# Altium schematic sheet Output_protection.SchDoc
size A3
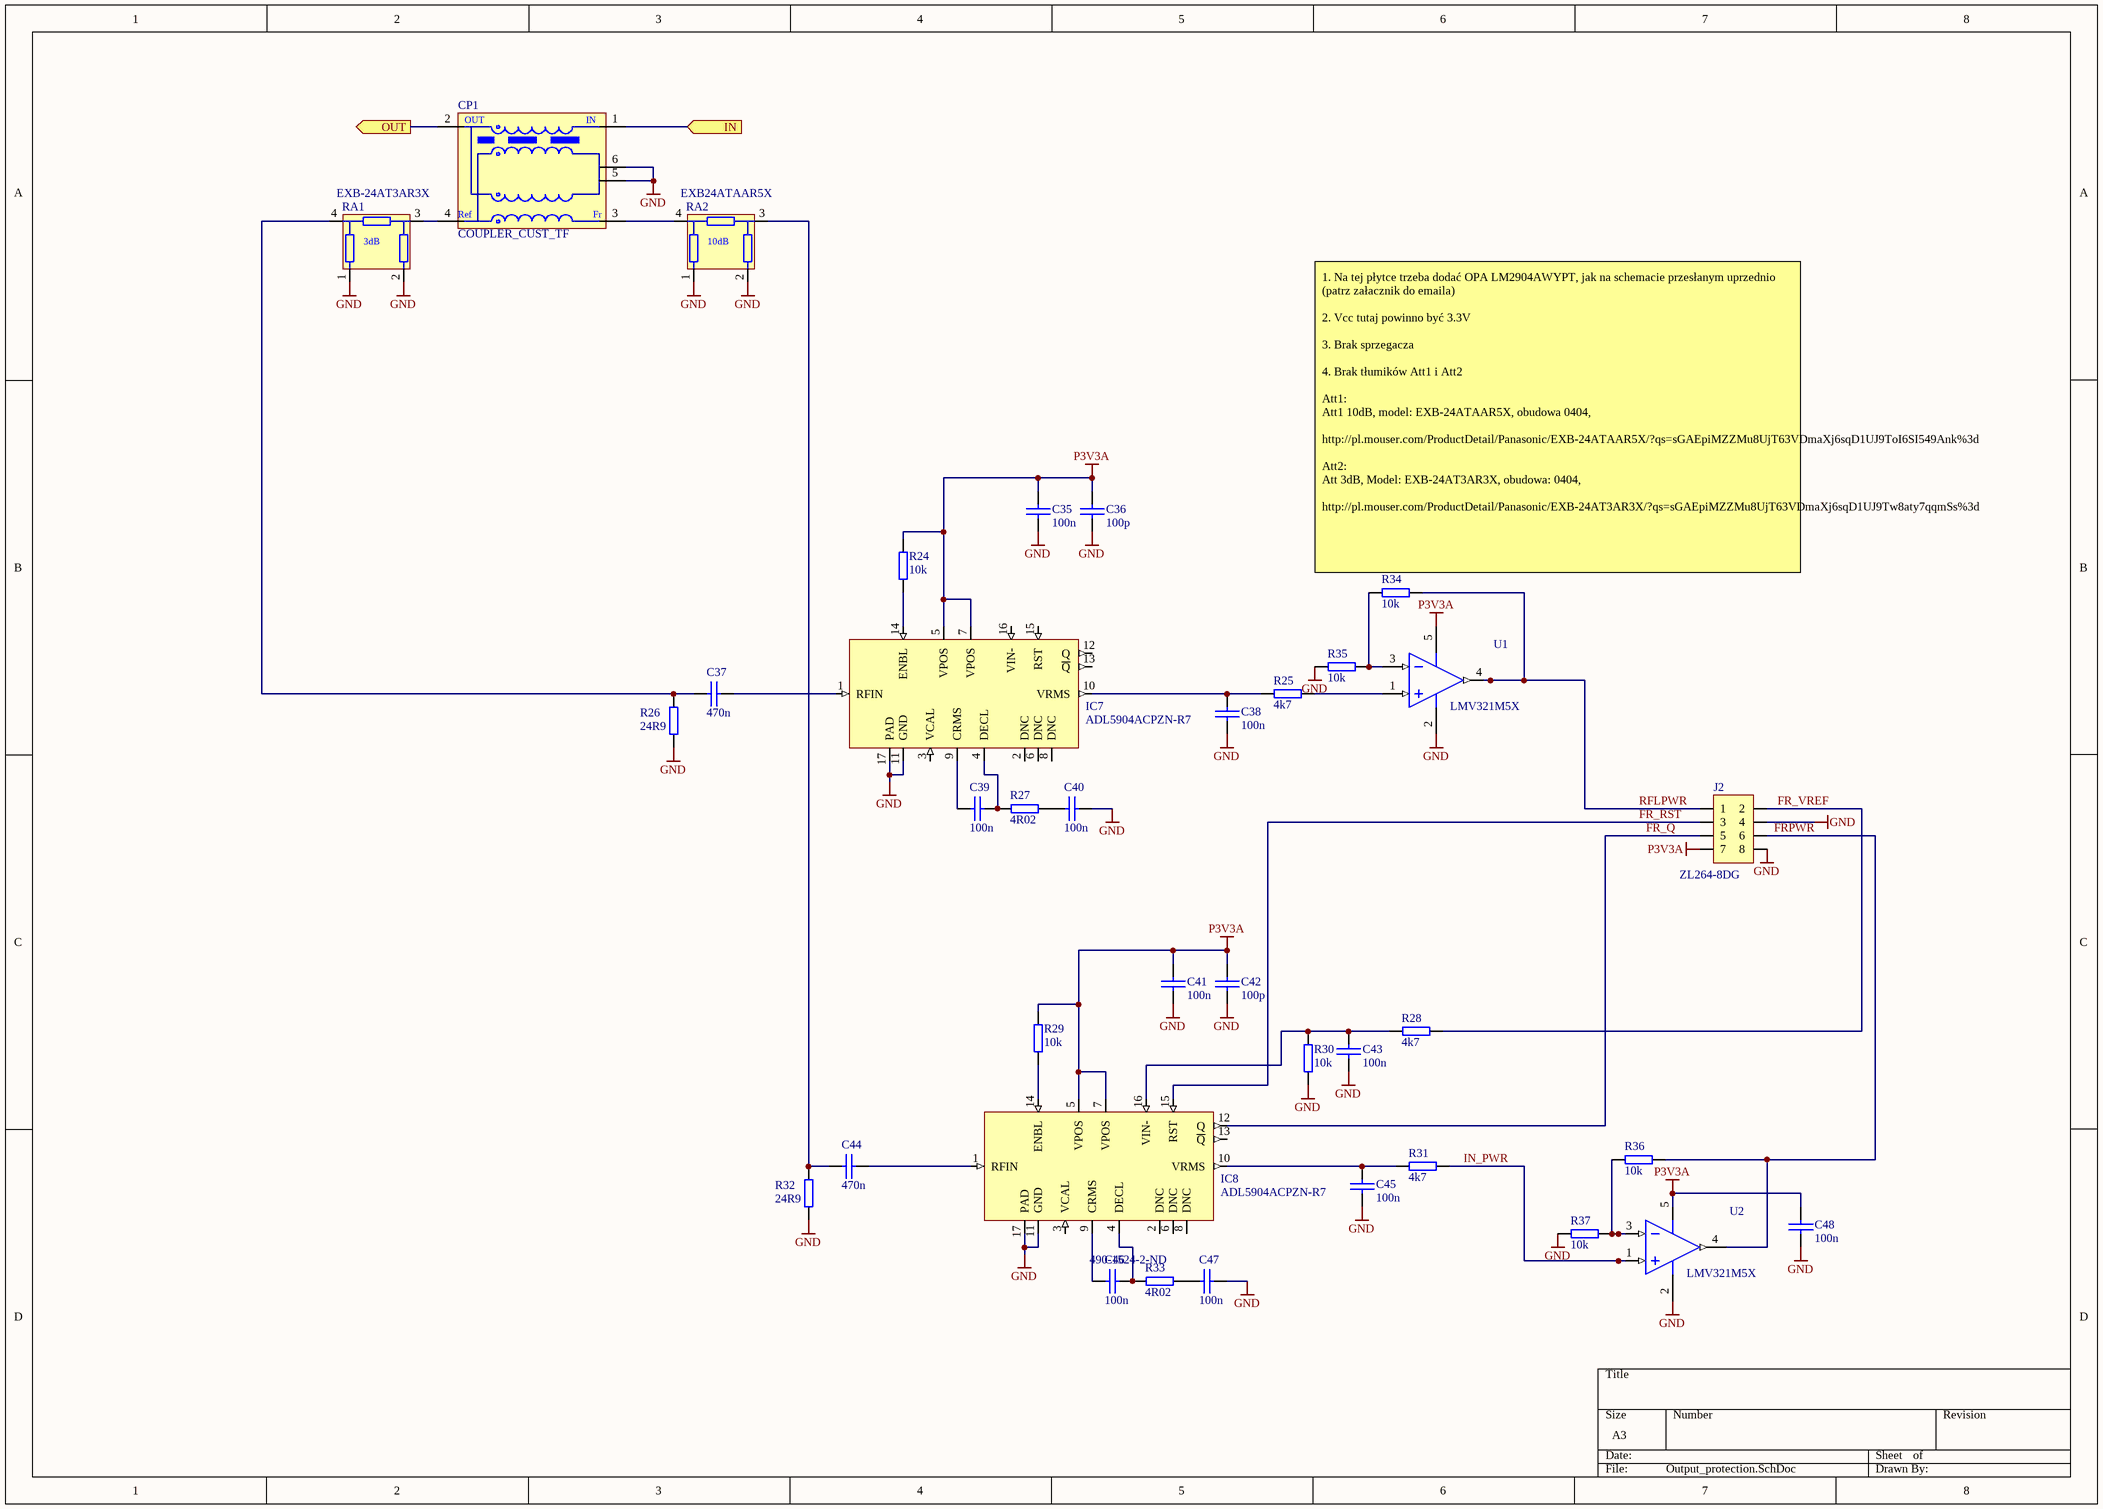
[diagram p0: Output_protection.SchDoc]

## Parts
C35  100n  [0603C]
C36  100p  [0603C]
C37  470n  [0603C]
C38  100n  [0603C]
C39  100n  [0603C]
C40  100n  [0603C]
C41  100n  [0603C]
C42  100p  [0603C]
C43  100n  [0603C]
C44  470n  [0603C]
C45  100n  [0603C]
C46  100n  Supplier Part Number 1: 490-1524-2-ND  [0603C]
C47  100n  [0603C]
C48  100n  [0603C]
CP1  COUPLER_CUST_TF  [COUPLER_CUST_TF]
IC7  ADL5904ACPZN-R7  [QFN50P300X300X80_HS-17N]
IC8  ADL5904ACPZN-R7  [QFN50P300X300X80_HS-17N]
J2  ZL264-8DG  [ZL264-8DG]
R24  10k  [0603R]
R25  4k7  [0603R]
R26  24R9  [0603R]
R27  4R02  [0603R]
R28  4k7  [0603R]
R29  10k  [0603R]
R30  10k  [0603R]
R31  4k7  [0603R]
R32  24R9  [0603R]
R33  4R02  [0603R]
R34  10k  [0603R]
R35  10k  [0603R]
R36  10k  [0603R]
R37  10k  [0603R]
RA1  EXB-24AT3AR3X  [CAC-65P100X100-4L]
RA2  EXB24ATAAR5X  [CAC-65P100X100-4L]
U1  LMV321M5X  [DBV0005A_N]
U2  LMV321M5X  [DBV0005A_N]

## Ports
IN (in), OUT (out)

## Nets
GND: C35.2 C36.2 C38.1 C40.2 C41.2 C42.2 C43.1 C45.1 C47.2 C48.1 CP1.5 CP1.6 IC7.11(GND) IC7.17(PAD) IC8.11(GND) IC8.17(PAD) J2.4 J2.8 R26.2 R30.1 R32.2 R35.2 R37.2 RA1.1 RA1.2 RA2.1 RA2.2 U1.2(V-) U2.2(V-)
P3V3A: C35.1 C36.1 C41.1 C42.1 C48.2 IC7.5(VPOS) IC7.7(VPOS) IC8.5(VPOS) IC8.7(VPOS) J2.7 R24.1 R29.1 U1.5(V+) U2.5(V+)
FR_Q: IC8.12(Q) J2.5
FR_RST: IC8.15(RST) J2.3
FR_VREF: J2.2 R28.1
FRPWR: J2.6 R36.1 U2.4(OUT)
IN: CP1.1 ; port IN
IN_PWR: R31.1 U2.1(IN+)
OUT: CP1.2 ; port OUT
RFLPWR: J2.1 R34.1 U1.4(OUT)
NetC37_1: C37.1 R26.1 RA1.4
NetC37_2: C37.2 IC7.1(RFIN)
NetC38_2: C38.2 IC7.10(VRMS) R25.2
NetC39_1: C39.1 IC7.9(CRMS)
NetC39_2: C39.2 IC7.4(DECL) R27.1
NetC40_1: C40.1 R27.2
NetC43_2: C43.2 IC8.16(VIN-) R28.2 R30.2
NetC44_1: C44.1 R32.1 RA2.3
NetC44_2: C44.2 IC8.1(RFIN)
NetC45_2: C45.2 IC8.10(VRMS) R31.2
NetC46_1: C46.1 IC8.9(CRMS)
NetC46_2: C46.2 IC8.4(DECL) R33.1
NetC47_1: C47.1 R33.2
NetCP1_3: CP1.3 RA2.4
NetCP1_4: CP1.4 RA1.3
NetIC7_14: IC7.14(ENBL) R24.2
NetIC8_14: IC8.14(ENBL) R29.2
NetR25_1: R25.1 U1.1(IN+)
NetR34_2: R34.2 R35.1 U1.3(IN-)
NetR36_2: R36.2 R37.1 U2.3(IN-)

Not connected (* = marked no-connect by the designer): IC7 2(DNC) 3(VCAL) 6(DNC) 8(DNC) 12(Q) 13(~{Q}) 15(RST) 16(VIN-); IC8 2(DNC) 3(VCAL) 6(DNC) 8(DNC) 13(~{Q})

## Notes on the sheet
- (near R34) 1. Na tej płytce trzeba dodać OPA LM2904AWYPT, jak na schemacie przesłanym uprzednio
  (patrz załacznik do emaila)
  2. Vcc tutaj powinno być 3.3V
  3. Brak sprzegacza
  4. Brak tłumików Att1 i Att2
  Att1:
  Att1 10dB, model: EXB-24ATAAR5X, obudowa 0404,
  http://pl.mouser.com/ProductDetail/Panasonic/EXB-24ATAAR5X/?qs=sGAEpiMZZMu8UjT63VDmaXj6sqD1UJ9ToI6SI549Ank%3d
  Att2:
  Att 3dB, Model: EXB-24AT3AR3X, obudowa: 0404,
  http://pl.mouser.com/ProductDetail/Panasonic/EXB-24AT3AR3X/?qs=sGAEpiMZZMu8UjT63VDmaXj6sqD1UJ9Tw8aty7qqmSs%3d
- (in symbol IND_COUPLER_TF) OUT; IN; Ref; Fr
- (in symbol RES_ATT_3dB) 3dB
- (in symbol RES_ATT_10dB) 10dB

## Library data of the parts
C35 C38-C41 C43 C45-C48 = CAP_SMD_0603: Capacitor SMD; Part: GRM188L81H104KA93D
  C35 C38-C40 C43 C45 C47 C48: Supplier 1: Digi-Key
C36 C42 = CAP_SMD_0603: Capacitor SMD; Part: C1608NP01H101J080AA; Supplier 1: Digi-Key
C37 C44 = CAP_SMD_0603: Capacitor SMD; Part: GRM188R71A474KA61D; Supplier 1: Digi-Key
CP1 = IND_COUPLER_TF: custom coupler
IC7 IC8 = ADL5904: DC   to 6 GHz  , 45 dB DC  to 6 GHz , 45 dB TruPwr Detector with Envelope Threshold Detection
J2 = CON_2X4 2.54 SMT FEM: 2.54mm pitch connector
R24 R29 R30 R34-R37 = RES_0603: SMD Resistor; Part: CRCW060310K0FKEA; Supplier 1: Newark
  R29 R34-R37: Supplier Part Number 1: 39K0073
R25 R28 R31 = RES_0603: SMD Resistor; Part: CR0603-FX-4701ELF; Supplier 1: Newark; Supplier Part Number 1: 39K0073
R26 R32 = RES_0603: SMD Resistor; Part: CPF0603F24R9C1; Supplier 1: Newark
R27 = RES_0603: SMD Resistor; Part: CRCW06034R02FKEA; Supplier 1: Newark
R33 = RES_0603: SMD Resistor; Supplier 1: Newark; Supplier Part Number 1: 39K0073
RA1 = RES_ATT_3dB: 3dB Chip Attenuator
RA2 = RES_ATT_10dB: 10dB Chip Attenuator
U1 U2 = CMP-0055-01048-3: General Purpose, Low Voltage, Rail-to-Rail Output Operational Amplifiers, 5-pin SOT-23; Manufacturer: Texas Instruments; PackageTopMarking: A13*XTT; PowerWise: N; Package Reference: DBV0005A; PackageDescription: Molded SOT-23, .115 x .063 x .040 in Body, 5 Lead, .0375 in Pitch; CompType: Amplifiers; RoHS: N; ComponentLink1URL: http://www.ti.com/general/docs/lit/getliterature.tsp?genericPartNumber=LMV321-N&fileType=pdf; PinCount: 5; ComponentLink1Description: Datasheet URL